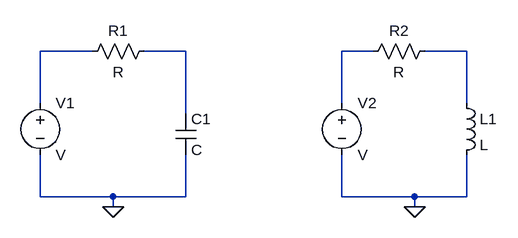
[diagram p0: schematic Draft1.asc]
Draft1.asc, the LTspice schematic file:
Version 4
SHEET 1 880 680
WIRE -32 -112 -112 -112
WIRE 112 -112 48 -112
WIRE 400 -112 352 -112
WIRE 544 -112 480 -112
WIRE -112 -32 -112 -112
WIRE 352 -32 352 -112
WIRE 544 -32 544 -112
WIRE 112 -16 112 -112
WIRE -112 112 -112 48
WIRE 0 112 -112 112
WIRE 112 112 112 48
WIRE 112 112 0 112
WIRE 352 112 352 48
WIRE 464 112 352 112
WIRE 544 112 544 48
WIRE 544 112 464 112
WIRE 0 128 0 112
WIRE 464 128 464 112
FLAG 0 128 0
FLAG 464 128 0
SYMBOL voltage -112 -48 R0
SYMATTR InstName V1
SYMBOL voltage 352 -48 R0
SYMATTR InstName V2
SYMBOL cap 96 -16 R0
SYMATTR InstName C1
SYMBOL ind 528 -48 R0
SYMATTR InstName L1
SYMBOL res 64 -128 R90
WINDOW 0 0 56 VBottom 2
WINDOW 3 32 56 VTop 2
SYMATTR InstName R1
SYMBOL res 496 -128 R90
WINDOW 0 0 56 VBottom 2
WINDOW 3 32 56 VTop 2
SYMATTR InstName R2

The netlist it stands for:
* Draft1.asc
V1 N001 0 V
V2 N003 0 V
C1 N002 0 C
L1 N004 0 L
R1 N002 N001 R
R2 N004 N003 R
.backanno
.end